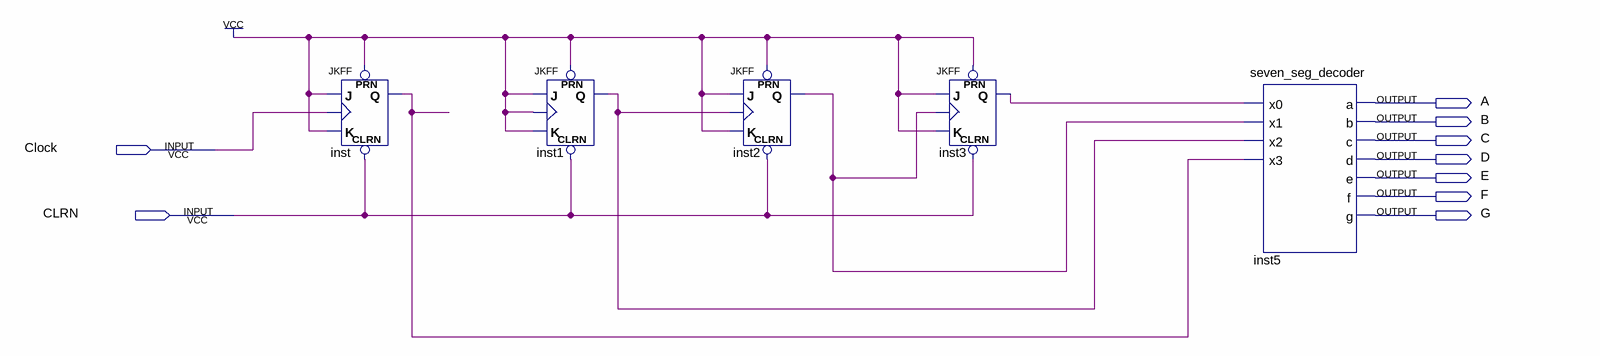
[diagram p0: schematic sheet]
// Quartus schematic lab10step3a.bdf as structural Verilog: 5 symbols, 9 pins
module lab10step3a (
  input  Clock,
  input  CLRN,
  output A,
  output B,
  output C,
  output D,
  output E,
  output F,
  output G
);

  wire inst1_q, inst2_q, inst3_q, inst_q;

  JKFF inst (.PRN(1'b1), .CLRN(CLRN), .K(1'b1), .J(1'b1), .CLK(Clock), .Q(inst_q));
  JKFF inst1 (.PRN(1'b1), .CLRN(CLRN), .K(1'b1), .J(1'b1), .CLK(1'b1), .Q(inst1_q));
  JKFF inst2 (.PRN(1'b1), .CLRN(CLRN), .K(1'b1), .J(1'b1), .CLK(inst1_q), .Q(inst2_q));
  JKFF inst3 (.PRN(1'b1), .CLRN(CLRN), .K(1'b1), .J(1'b1), .CLK(inst2_q), .Q(inst3_q));
  seven_seg_decoder inst5 (
    .x0(inst3_q), .x1(inst2_q), .x2(inst1_q), .x3(inst_q), .a(A), .b(B), .c(C), .d(D), .e(E), .f(F), .g(G));
endmodule
